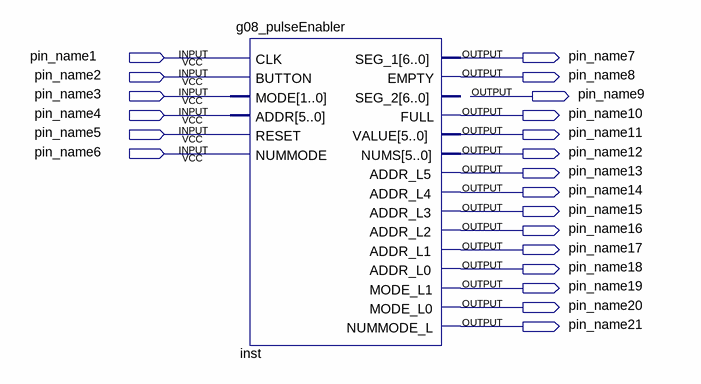
[diagram p0: schematic sheet]
// Quartus schematic g08_lab3.bdf as structural Verilog: 1 symbols, 21 pins
module g08_lab3 (
  input  pin_name1,
  input  pin_name2,
  input  pin_name3,
  input  pin_name4,
  input  pin_name5,
  input  pin_name6,
  output pin_name7,
  output pin_name8,
  output pin_name9,
  output pin_name10,
  output pin_name11,
  output pin_name12,
  output pin_name13,
  output pin_name14,
  output pin_name15,
  output pin_name16,
  output pin_name17,
  output pin_name18,
  output pin_name19,
  output pin_name20,
  output pin_name21
);

  g08_pulseEnabler inst (
    .CLK(pin_name1), .BUTTON(pin_name2), .MODE({2{pin_name3}}), .ADDR({6{pin_name4}}), .RESET(pin_name5),
    .NUMMODE(pin_name6), .SEG_1(pin_name7), .EMPTY(pin_name8), .FULL(pin_name10), .VALUE(pin_name11),
    .NUMS(pin_name12), .ADDR_L5(pin_name13), .ADDR_L4(pin_name14), .ADDR_L3(pin_name15),
    .ADDR_L2(pin_name16), .ADDR_L1(pin_name17), .ADDR_L0(pin_name18), .MODE_L1(pin_name19),
    .MODE_L0(pin_name20), .NUMMODE_L(pin_name21));  // open: SEG_2
endmodule
